# EAGLE schematic schematic (EAGLE 6.5.0)
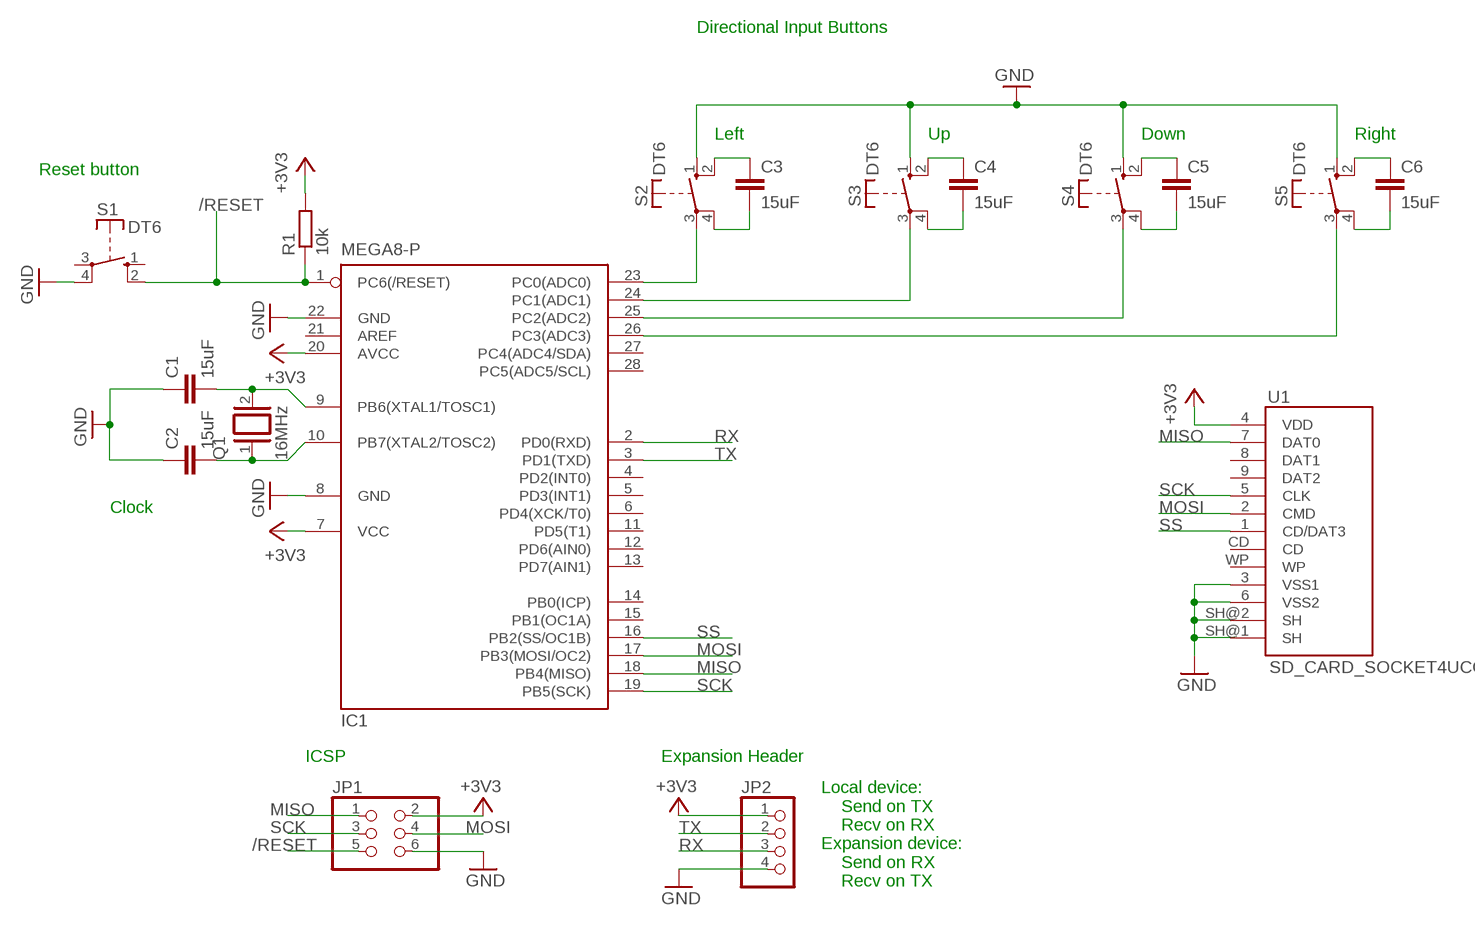
[diagram p0: schematic, sheet 1]

## Parts
C1  15uF  C-EU025-024X044  [C025-024X044]
C2  15uF  C-EU025-024X044  [C025-024X044]
C3  15uF  C-EU025-024X044  [C025-024X044]
C4  15uF  C-EU025-024X044  [C025-024X044]
C5  15uF  C-EU025-024X044  [C025-024X044]
C6  15uF  C-EU025-024X044  [C025-024X044]
IC1  MEGA8-P  [DIL28-3]
JP1  PINHD-2X3  [2X03]
JP2  PINHD-1X4  [1X04]
Q1  16MHz  XTAL  [Q]
R1  10k  R-EU_0204/7  [0204/7]
S1  DT6  [DT6]
S2  DT6  [DT6]
S3  DT6  [DT6]
S4  DT6  [DT6]
S5  DT6  [DT6]
U1  SD_CARD_SOCKET4UCON  [SDCARD_4UCONN]

## Nets
+3V3: IC1.7(VCC) IC1.20(AVCC) JP1.2 JP2.1 R1.2 U1.4(VDD)
/RESET: IC1.1(PC6(/RESET)) JP1.5 R1.1 S1.2(S)
GND: C1.1 C2.1 IC1.8(GND) IC1.22(GND) JP1.6 JP2.4 S1.4(P) S2.1(S) S3.1(S) S4.1(S) S5.1(S) U1.3(VSS1) U1.6(VSS2) U1.SH@1(SH) U1.SH@2(SH)
MISO: IC1.18(PB4(MISO)) JP1.1 U1.7(DAT0)
MOSI: IC1.17(PB3(MOSI/OC2)) JP1.4 U1.2(CMD)
N$1: C2.2 IC1.10(PB7(XTAL2/TOSC2)) Q1.1
N$2: C1.2 IC1.9(PB6(XTAL1/TOSC1)) Q1.2
N$4: C3.2 S2.4(P)
N$5: C4.2 S3.4(P)
N$6: C5.2 S4.4(P)
N$7: C6.2 S5.4(P)
N$8: C3.1 S2.2(S)
N$9: C4.1 S3.2(S)
N$10: C5.1 S4.2(S)
N$11: C6.1 S5.2(S)
N$12: IC1.23(PC0(ADC0)) S2.3(P)
N$13: IC1.24(PC1(ADC1)) S3.3(P)
N$14: IC1.25(PC2(ADC2)) S4.3(P)
N$15: IC1.26(PC3(ADC3)) S5.3(P)
RX: IC1.2(PD0(RXD)) JP2.3
SCK: IC1.19(PB5(SCK)) JP1.3 U1.5(CLK)
SS: IC1.16(PB2(SS/OC1B)) U1.1(CD/DAT3)
TX: IC1.3(PD1(TXD)) JP2.2
Unconnected: IC1.4(PD2(INT0)) IC1.5(PD3(INT1)) IC1.6(PD4(XCK/T0)) IC1.11(PD5(T1)) IC1.12(PD6(AIN0)) IC1.13(PD7(AIN1)) IC1.14(PB0(ICP)) IC1.15(PB1(OC1A)) IC1.21(AREF) IC1.27(PC4(ADC4/SDA)) IC1.28(PC5(ADC5/SCL)) S1.1(S) S1.3(P) U1.8(DAT1) U1.9(DAT2) U1.CD U1.WP

## Notes on the sheet
- Directional Input Buttons
- Left | Up | Down | Right
- Reset button
- Clock
- ICSP | Expansion Header
- Local device:
      Send on TX
      Recv on RX
  Expansion device:
      Send on RX
      Recv on TX

## Library data of the parts
C1-C6 = rcl:C-EU: CAPACITOR, European symbol
IC1 = atmel:MEGA8-P: MICROCONTROLLER 8 Kbytes FLASH, 1 kbytes SRAM, 512 bytes EEPROM, USART, 4-channel 10 bit ADC, 2-channel 8 bit ADC Pin compatible with Atmega48, ATMega88, ATMega168 Source: avr.lbr; OC_FARNELL: unknown; OC_NEWARK: unknown
JP1 = pinhead:PINHD-2X3: PIN HEADER
JP2 = pinhead:PINHD-1X4: PIN HEADER
Q1 = special:XTAL: CRYSTAL
R1 = rcl:R-EU_: RESISTOR, European symbol
S1-S5 = switch-misc:DT: ITT SWITCH
U1 = sfe:SD_CARD_SOCKET: SD Memory Card Connector, push-push normal type, CD enable, WP enable